# EAGLE design analogrpi (EAGLE 5.11)
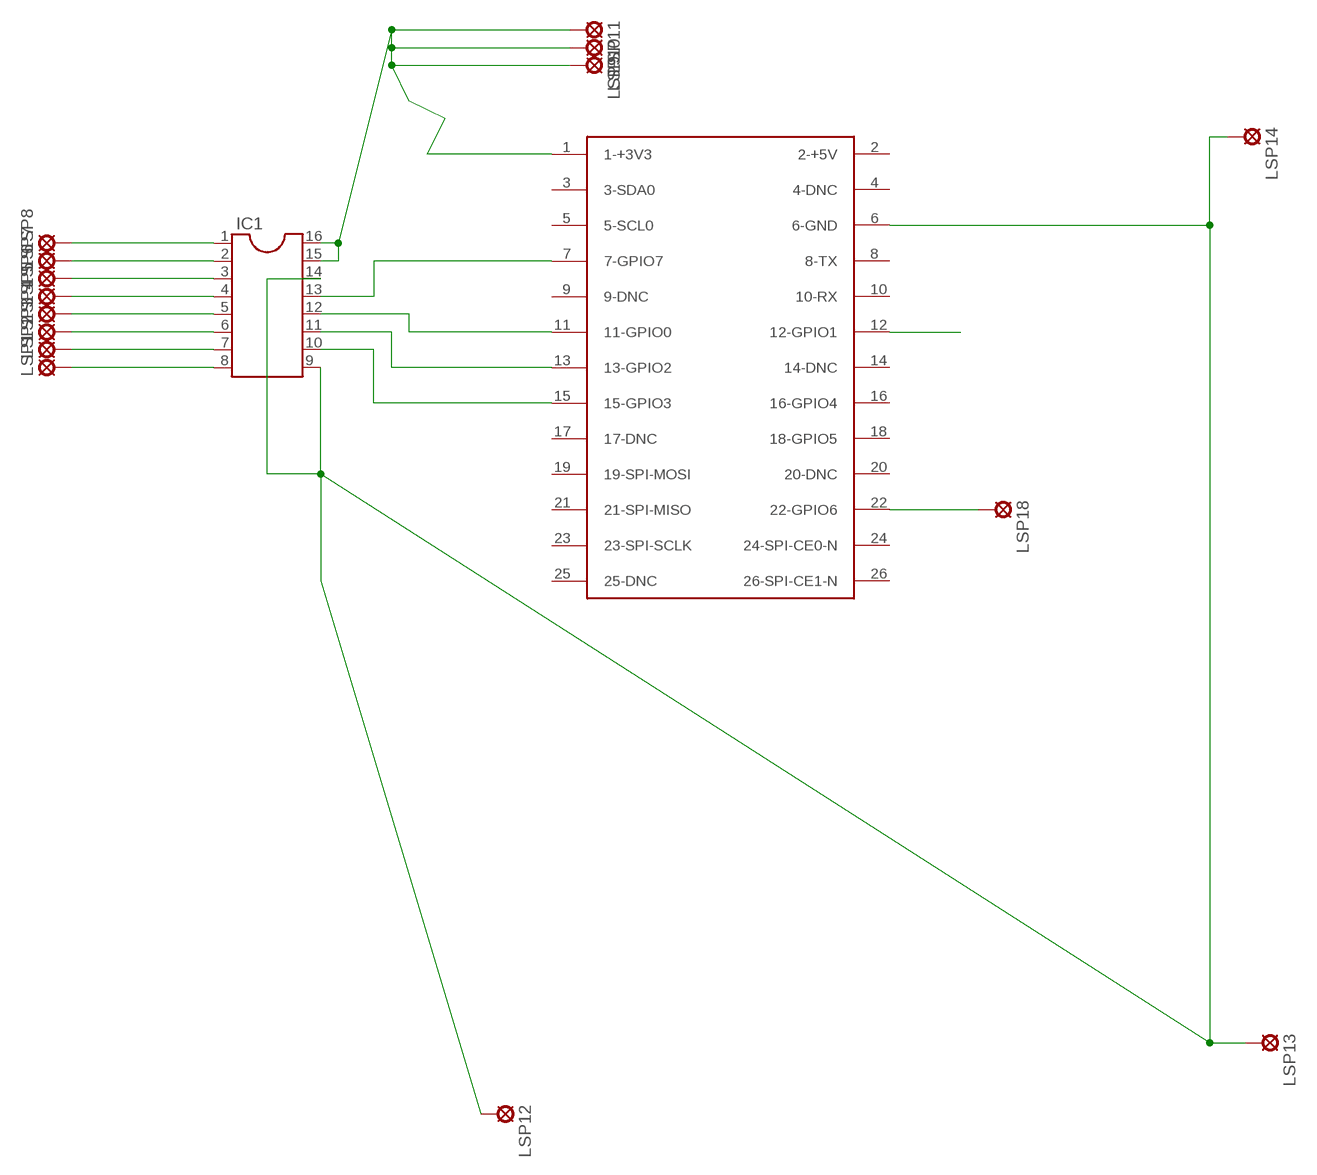
[diagram p0: schematic, sheet 1]

## Parts
IC1  DIL16  [DIL16]
LSP1  LSP10  [LSP10]
LSP2  LSP10  [LSP10]
LSP3  LSP10  [LSP10]
LSP4  LSP10  [LSP10]
LSP5  LSP10  [LSP10]
LSP6  LSP10  [LSP10]
LSP7  LSP10  [LSP10]
LSP8  LSP10  [LSP10]
LSP9  LSP10  [LSP10]
LSP10  LSP10  [LSP10]
LSP11  LSP10  [LSP10]
LSP12  LSP10  [LSP10]
LSP13  LSP10  [LSP10]
LSP14  LSP10  [LSP10]
LSP18  LSP10  [LSP10]
U$1  RASPBERRY-PI  [RASPBERRY-PI]

## Nets
N$1: IC1.15 IC1.16 LSP9.MP LSP10.MP LSP11.MP U$1.1(1-+3V3)
N$2: U$1.12(12-GPIO1)
N$5: LSP18.MP U$1.22(22-GPIO6)
N$6: IC1.9 IC1.14 LSP12.MP LSP13.MP LSP14.MP U$1.6(6-GND)
N$7: IC1.13 U$1.7(7-GPIO7)
N$8: IC1.12 U$1.11(11-GPIO0)
N$9: IC1.11 U$1.13(13-GPIO2)
N$10: IC1.10 U$1.15(15-GPIO3)
N$11: IC1.7 LSP2.MP
N$12: IC1.5 LSP4.MP
N$13: IC1.4 LSP5.MP
N$14: IC1.3 LSP6.MP
N$15: IC1.2 LSP7.MP
N$16: IC1.6 LSP3.MP
N$17: IC1.1 LSP8.MP
N$18: IC1.8 LSP1.MP
Unconnected: U$1.2(2-+5V) U$1.3(3-SDA0) U$1.4(4-DNC) U$1.5(5-SCL0) U$1.8(8-TX) U$1.9(9-DNC) U$1.10(10-RX) U$1.14(14-DNC) U$1.16(16-GPIO4) U$1.17(17-DNC) U$1.18(18-GPIO5) U$1.19(19-SPI-MOSI) U$1.20(20-DNC) U$1.21(21-SPI-MISO) U$1.23(23-SPI-SCLK) U$1.24(24-SPI-CE0-N) U$1.25(25-DNC) U$1.26(26-SPI-CE1-N)

## Library data of the parts
IC1 = ic-package:DIL16: Dual In Line / Socket
LSP1-LSP14 LSP18 = solpad:LSP10: SOLDER PAD drill 1.0 mm, distributor Buerklin, 12H555
U$1 = RaspberryPi:RASPBERRY-PI: Raspberry Pi Board <http://www.raspberrypi.org/> Jacques Lagnel V1.0 (beta) 2012 Board dimension: Forum 3D model <http://www.raspberrypi.org/forum/general-discussion/mechanical-profile-3d-models?value=3d%20model&type=1&include=1&search=1&ret=all> The GPIO Connector (P1): http://elinux.org/RPi_Low-level_peripherals

## Board
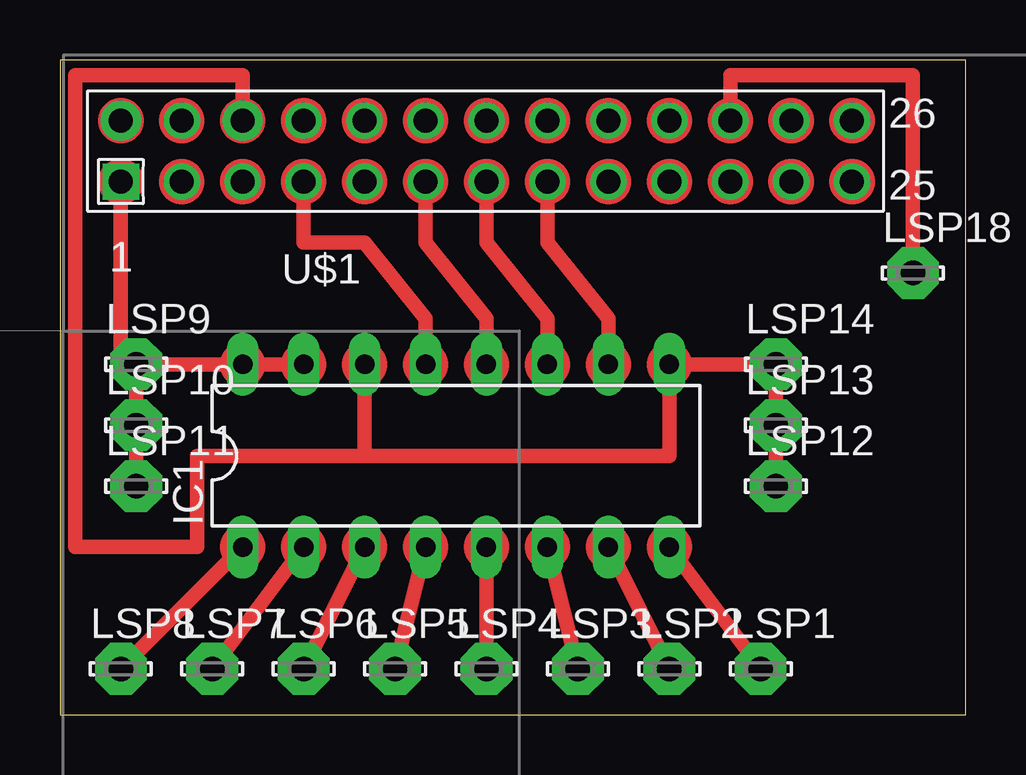
[diagram p1: board, top side]

Size 37.77 x 27.3 mm. Coordinates in mm from the lower left corner, seen from the top.
Outline: 0,0 37.77,0 37.77,27.3 0,27.3 0,0
Copper layers (1*16): Top 0.035mm / dielectric 1.5mm / Bottom 0.035mm
Design rules "default": minimum track width 10mil, minimum drill 24mil, track to track 8mil, track to pad 8mil, pad to pad 8mil, via to via 8mil, smd to smd 8mil, copper to edge 40mil, drill to drill 8mil, minimum pad ring 10mil, minimum via ring 8mil, stop-mask expansion 4mil, vias tented up to drill 0mil, thermal gap 10mil

### Footprints (pad centres in the part's own frame; a part is rotated, then mirrored left to right if it is on the bottom)
DIL16 = drill 0.813 long: 1 -8.89,-3.81; 2 -6.35,-3.81; 3 -3.81,-3.81; 4 -1.27,-3.81; 5 1.27,-3.81; 6 3.81,-3.81; 7 6.35,-3.81; 8 8.89,-3.81; 9 8.89,3.81; 10 6.35,3.81; 11 3.81,3.81; 12 1.27,3.81; 13 -1.27,3.81; 14 -3.81,3.81; 15 -6.35,3.81; 16 -8.89,3.81
LSP10 = drill 1.016 pad 2.159 octagon: MP 0,0
RASPBERRY-PI = drill 1 square: 1 0,0 | drill 1 pad 1.676 round: 2 0,2.54; 6 5.08,2.54 | drill 1 round: 3 2.54,0; 4 2.54,2.54; 5 5.08,0; 7 7.62,0; 8 7.62,2.54; 9 10.16,0; 10 10.16,2.54; 11 12.7,0; 12 12.7,2.54; 13 15.24,0; 14 15.24,2.54; 15 17.78,0; 16 17.78,2.54; 17 20.32,0; 18 20.32,2.54; 19 22.86,0; 20 22.86,2.54; 21 25.4,0; 22 25.4,2.54; 23 27.94,0; 24 27.94,2.54; 25 30.48,0; 26 30.48,2.54

### Placement (x,y rotation side)
IC1  16.51,10.79 0 top
LSP1  29.21,1.9 0 top
LSP2  25.4,1.9 0 top
LSP3  21.59,1.9 0 top
LSP4  17.78,1.9 0 top
LSP5  13.97,1.9 0 top
LSP6  10.16,1.9 0 top
LSP7  6.35,1.9 0 top
LSP8  2.54,1.9 0 top
LSP9  3.18,14.61 0 top
LSP10  3.18,12.06 0 top
LSP11  3.18,9.52 0 top
LSP12  29.85,9.52 0 top
LSP13  29.85,12.06 0 top
LSP14  29.85,14.61 0 top
LSP18  35.56,18.41 0 top
U$1  2.54,22.23 0 top

### Tracks (layer width: path | path; a pad name or v marks a point on that pad's centre or on a via)
N$1
  Top 0.61: LSP11.MP LSP10.MP LSP9.MP | IC1.15 IC1.16 LSP9.MP | LSP9.MP 2.54,14.61 U$1.1
N$5
  Top 0.61: U$1.22 27.94,26.67 35.56,26.67 LSP18.MP
N$6
  Top 0.61: U$1.6 7.62,26.67 0.64,26.67 0.64,6.98 5.71,6.98 5.71,10.79 12.7,10.79 | 12.7,10.79 IC1.14 | LSP12.MP LSP13.MP LSP14.MP IC1.9 25.4,10.79 12.7,10.79
N$7
  Top 0.61: IC1.13 15.24,16.51 12.7,19.69 10.16,19.69 U$1.7
N$8
  Top 0.61: IC1.12 17.78,16.51 15.24,19.69 U$1.11
N$9
  Top 0.254: U$1.13 17.78,22.86
  Top 0.61: IC1.11 20.32,16.51 17.78,19.69 U$1.13
N$10
  Top 0.61: U$1.15 20.32,19.69 22.86,16.51 IC1.10
N$11
  Top 0.61: IC1.7 LSP2.MP
N$12
  Top 0.61: IC1.5 LSP4.MP
N$13
  Top 0.61: IC1.4 LSP5.MP
N$14
  Top 0.61: IC1.3 LSP6.MP
N$15
  Top 0.61: IC1.2 LSP7.MP
N$16
  Top 0.61: LSP3.MP IC1.6
N$17
  Top 0.61: IC1.1 LSP8.MP
N$18
  Top 0.61: LSP1.MP IC1.8
(copper drawn outside any net)
  shapes: Top circle x57